# Altium schematic sheet Battery Front End.SchDoc
size Tabloid; Date: Date; Author: Author 1; Revision: 1; Size: 11x17; Sheet_Name: Battery front end
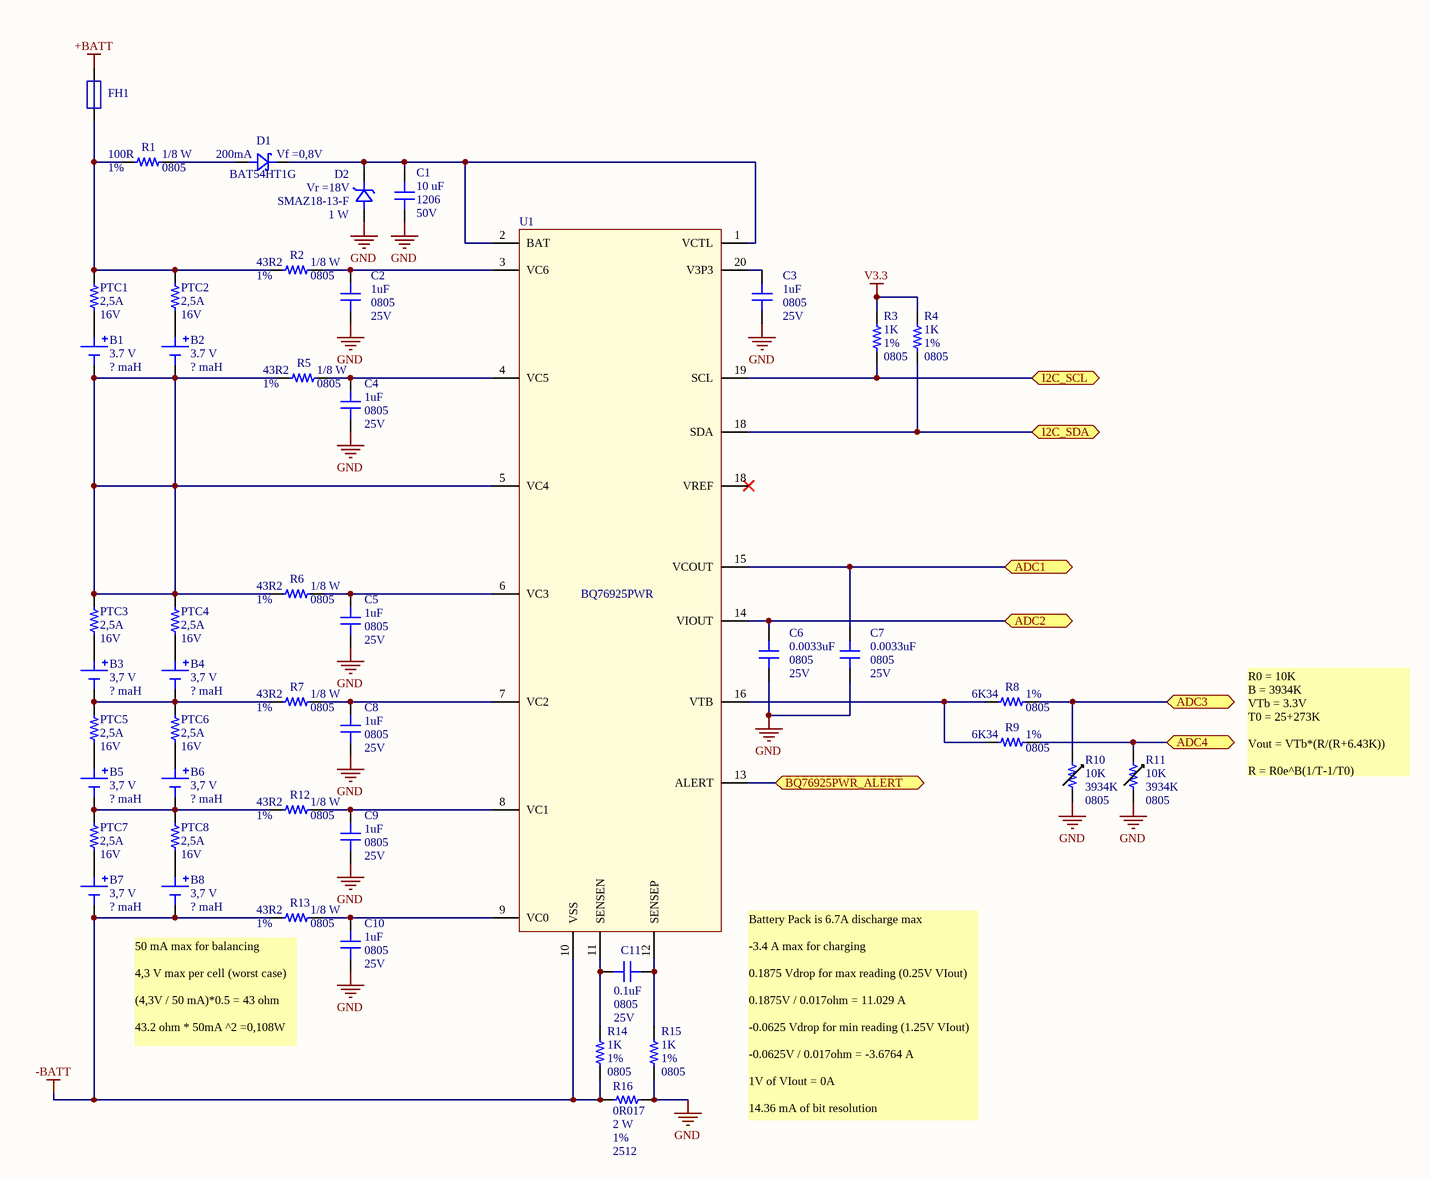
[diagram p0: Battery Front End.SchDoc]

## Parts
B1  Voltage: 3.7 V  Charge: ? maH  [18650 PC PIN]  (hidden comment: Battery Cell 18650)
B2  Voltage: 3.7 V  Charge: ? maH  [18650 PC PIN]  (hidden comment: Battery Cell 18650)
B3  Voltage: 3,7 V  Charge: ? maH  [18650 PC PIN]  (hidden comment: Battery Cell 18650)
B4  Voltage: 3,7 V  Charge: ? maH  [18650 PC PIN]  (hidden comment: Battery Cell 18650)
B5  Voltage: 3,7 V  Charge: ? maH  [18650 PC PIN]  (hidden comment: Battery Cell 18650)
B6  Voltage: 3,7 V  Charge: ? maH  [18650 PC PIN]  (hidden comment: Battery Cell 18650)
B7  Voltage: 3,7 V  Charge: ? maH  [18650 PC PIN]  (hidden comment: Battery Cell 18650)
B8  Voltage: 3,7 V  Charge: ? maH  [18650 PC PIN]  (hidden comment: Battery Cell 18650)
C1  value 10 uF  Package: 1206  Voltage: 50V  [CAP_1206]  (hidden comment: CAP - 1206)
C2  value 1uF  Package: 0805  Voltage: 25V  [CAP_0805]  (hidden comment: CAP - 0805)
C3  value 1uF  Package: 0805  Voltage: 25V  [CAP_0805]  (hidden comment: CAP - 0805)
C4  value 1uF  Package: 0805  Voltage: 25V  [CAP_0805]  (hidden comment: CAP - 0805)
C5  value 1uF  Package: 0805  Voltage: 25V  [CAP_0805]  (hidden comment: CAP - 0805)
C6  value 0.0033uF  Package: 0805  Voltage: 25V  [CAP_0805]  (hidden comment: CAP - 0805)
C7  value 0.0033uF  Package: 0805  Voltage: 25V  [CAP_0805]  (hidden comment: CAP - 0805)
C8  value 1uF  Package: 0805  Voltage: 25V  [CAP_0805]  (hidden comment: CAP - 0805)
C9  value 1uF  Package: 0805  Voltage: 25V  [CAP_0805]  (hidden comment: CAP - 0805)
C10  value 1uF  Package: 0805  Voltage: 25V  [CAP_0805]  (hidden comment: CAP - 0805)
C11  value 0.1uF  Package: 0805  Voltage: 25V  [CAP_0805]  (hidden comment: CAP - 0805)
D1  Current: 200mA  Vf: Vf =0,8V  Part number: BAT54HT1G  [SOD-323]  (hidden comment: SCHOTTKEY)
D2  Vf: Vr =18V  Part number: SMAZ18-13-F  Power: 1 W  [DO-214AC_SOD128]  (hidden comment: DIODE ZENER)
FH1  FH 3AB-3AG  [FH_3AB_3AG]  (value not drawn)
PTC1  Trip value: 2,5A  Voltage: 16V  [PTC - 1812]  (hidden comment: PTC - 1812)
PTC2  Trip value: 2,5A  Voltage: 16V  [PTC - 1812]  (hidden comment: PTC - 1812)
PTC3  Trip value: 2,5A  Voltage: 16V  [PTC - 1812]  (hidden comment: PTC - 1812)
PTC4  Trip value: 2,5A  Voltage: 16V  [PTC - 1812]  (hidden comment: PTC - 1812)
PTC5  Trip value: 2,5A  Voltage: 16V  [PTC - 1812]  (hidden comment: PTC - 1812)
PTC6  Trip value: 2,5A  Voltage: 16V  [PTC - 1812]  (hidden comment: PTC - 1812)
PTC7  Trip value: 2,5A  Voltage: 16V  [PTC - 1812]  (hidden comment: PTC - 1812)
PTC8  Trip value: 2,5A  Voltage: 16V  [PTC - 1812]  (hidden comment: PTC - 1812)
R1  value 100R  Watt: 1/8 W  Tolerance: 1%  Package: 0805  [RES_0805]  (hidden comment: RES - 0805)
R2  value 43R2  Watt: 1/8 W  Tolerance: 1%  Package: 0805  [RES_0805]  (hidden comment: RES - 0805)
R3  value 1K  Tolerance: 1%  Package: 0805  [RES_0805]  (hidden comment: RES - 0805)
R4  value 1K  Tolerance: 1%  Package: 0805  [RES_0805]  (hidden comment: RES - 0805)
R5  value 43R2  Watt: 1/8 W  Tolerance: 1%  Package: 0805  [RES_0805]  (hidden comment: RES - 0805)
R6  value 43R2  Watt: 1/8 W  Tolerance: 1%  Package: 0805  [RES_0805]  (hidden comment: RES - 0805)
R7  value 43R2  Watt: 1/8 W  Tolerance: 1%  Package: 0805  [RES_0805]  (hidden comment: RES - 0805)
R8  value 6K34  Tolerance: 1%  Package: 0805  [RES_0805]  (hidden comment: RES - 0805)
R9  value 6K34  Tolerance: 1%  Package: 0805  [RES_0805]  (hidden comment: RES - 0805)
R10  Resistance @ 25C: 10K  B: 3934K  Package: 0805  [RES_0805]  (hidden comment: TH - 0805)
R11  Resistance @ 25C: 10K  B: 3934K  Package: 0805  [RES_0805]  (hidden comment: TH - 0805)
R12  value 43R2  Watt: 1/8 W  Tolerance: 1%  Package: 0805  [RES_0805]  (hidden comment: RES - 0805)
R13  value 43R2  Watt: 1/8 W  Tolerance: 1%  Package: 0805  [RES_0805]  (hidden comment: RES - 0805)
R14  value 1K  Tolerance: 1%  Package: 0805  [RES_0805]  (hidden comment: RES - 0805)
R15  value 1K  Tolerance: 1%  Package: 0805  [RES_0805]  (hidden comment: RES - 0805)
R16  value 0R017  Watt: 2 W  Tolerance: 1%  Package: 2512  [RES_2512]  (hidden comment: RES - 2512)
U1  BQ76925PWR  [BQ76925]  (value not drawn)

## Ports
ADC1, ADC2, ADC3, ADC4, BQ76925PWR_ALERT, I2C_SCL, I2C_SDA

## Nets
+BATT: FH1.2
-BATT: B7.2 B8.2 R13.1 R14.1 R16.1 U1.10(VSS)
GND: C1.2 C2.2 C3.2 C4.2 C5.2 C6.2 C7.2 C8.2 C9.2 C10.2 D2.1 R10.2 R11.2 R15.1 R16.2
V3.3: R3.2 R4.2
ADC1: C7.1 U1.15(VCOUT) ; port ADC1
ADC2: C6.1 U1.14(VIOUT) ; port ADC2
ADC3: R8.1 R10.1 ; port ADC3
ADC4: R9.1 R11.1 ; port ADC4
BQ76925PWR_ALERT: U1.13(ALERT) ; port BQ76925PWR_ALERT
I2C_SCL: R3.1 U1.19(SCL) ; port I2C_SCL
I2C_SDA: R4.1 U1.18(SDA) ; port I2C_SDA
NetB1_1: B1.1 PTC1.2
NetB1_2: B1.2 B2.2 PTC3.1 PTC4.1 R5.1 R6.1 U1.5(VC4)
NetB2_1: B2.1 PTC2.2
NetB3_1: B3.1 PTC3.2
NetB3_2: B3.2 B4.2 PTC5.1 PTC6.1 R7.1
NetB4_1: B4.1 PTC4.2
NetB5_1: B5.1 PTC5.2
NetB5_2: B5.2 B6.2 PTC7.1 PTC8.1 R12.1
NetB6_1: B6.1 PTC6.2
NetB7_1: B7.1 PTC7.2
NetB8_1: B8.1 PTC8.2
NetC1_1: C1.1 D1.2 D2.2 U1.1(VCTL) U1.2(BAT)
NetC2_1: C2.1 R2.2 U1.3(VC6)
NetC3_1: C3.1 U1.20(V3P3)
NetC4_1: C4.1 R5.2 U1.4(VC5)
NetC5_1: C5.1 R6.2 U1.6(VC3)
NetC8_1: C8.1 R7.2 U1.7(VC2)
NetC9_1: C9.1 R12.2 U1.8(VC1)
NetC10_1: C10.1 R13.2 U1.9(VC0)
NetC11_1: C11.1 R14.2 U1.11(SENSEN)
NetC11_2: C11.2 R15.2 U1.12(SENSEP)
NetD1_1: D1.1 R1.2
NetFH1_1: FH1.1 PTC1.1 PTC2.1 R1.1 R2.1
NetR8_2: R8.2 R9.2 U1.16(VTB)

## Notes on the sheet
- R0 = 10K
  B = 3934K
  VTb = 3.3V
  T0 = 25+273K
  Vout = VTb*(R/(R+6.43K))
  R = R0e^B(1/T-1/T0)
- 50 mA max for balancing
  4,3 V max per cell (worst case)
  (4,3V / 50 mA)*0.5 = 43 ohm
  43.2 ohm * 50mA ^2 =0,108W
- (near U1) Battery Pack is 6.7A discharge max
  -3.4 A max for charging
  0.1875 Vdrop for max reading (0.25V VIout)
  0.1875V / 0.017ohm = 11.029 A
  -0.0625 Vdrop for min reading (1.25V VIout)
  -0.0625V / 0.017ohm = -3.6764 A
  1V of VIout = 0A
  14.36 mA of bit resolution
- Sheet Name
- Project Title
- Global Project
- Size
- Group
- Revision
- Date
- Sheet
- of
- Filename
- Designers

## Library data of the parts
B1-B8 = Battery Cell 18650: Part Number: 36-54-ND
C1 = CAP - 1206: Part number: GRT31CR61H106ME01L
C2-C5 C8-C10 = CAP - 0805: Part number: CL21B105KAFNNNE
C6 C7 = CAP - 0805: Part number: CL21B332KBANNNC
C11 = CAP - 0805: Part number: CC0805KRX7R8BB104
D2 = DIODE ZENER: Current: ?A
FH1 = FH 3AB-3AG: Fuse holder (3AB-3AG); Part number: 01020071Z x2
PTC1-PTC8 = PTC - 1812: Part number: 0ZCG0160BF2C; Res: ?; Package: 1812
R1 = RES - 0805: Part number: ERA-6AEB101V
R2 R5-R7 R12 R13 = RES - 0805: Part number: ERJ-6ENF43R2V
R3 R4 R14 R15 = RES - 0805: Part number: RNCP0805FTD1K00; Watt: 1/8 W
R8 R9 = RES - 0805: Part number: CRCW08056K34FKEA; Watt: 1/8 W
R10 R11 = TH - 0805: Part number: NCP21XV103J03RA
R16 = RES - 2512: Part number: WSL2512R0170FEA18
U1 = BQ76925PWR: Part Number: BQ76925PWR